# Altium schematic sheet Input Protection.SchDoc
size A4; SheetNumber: 8; SheetTotal: 14
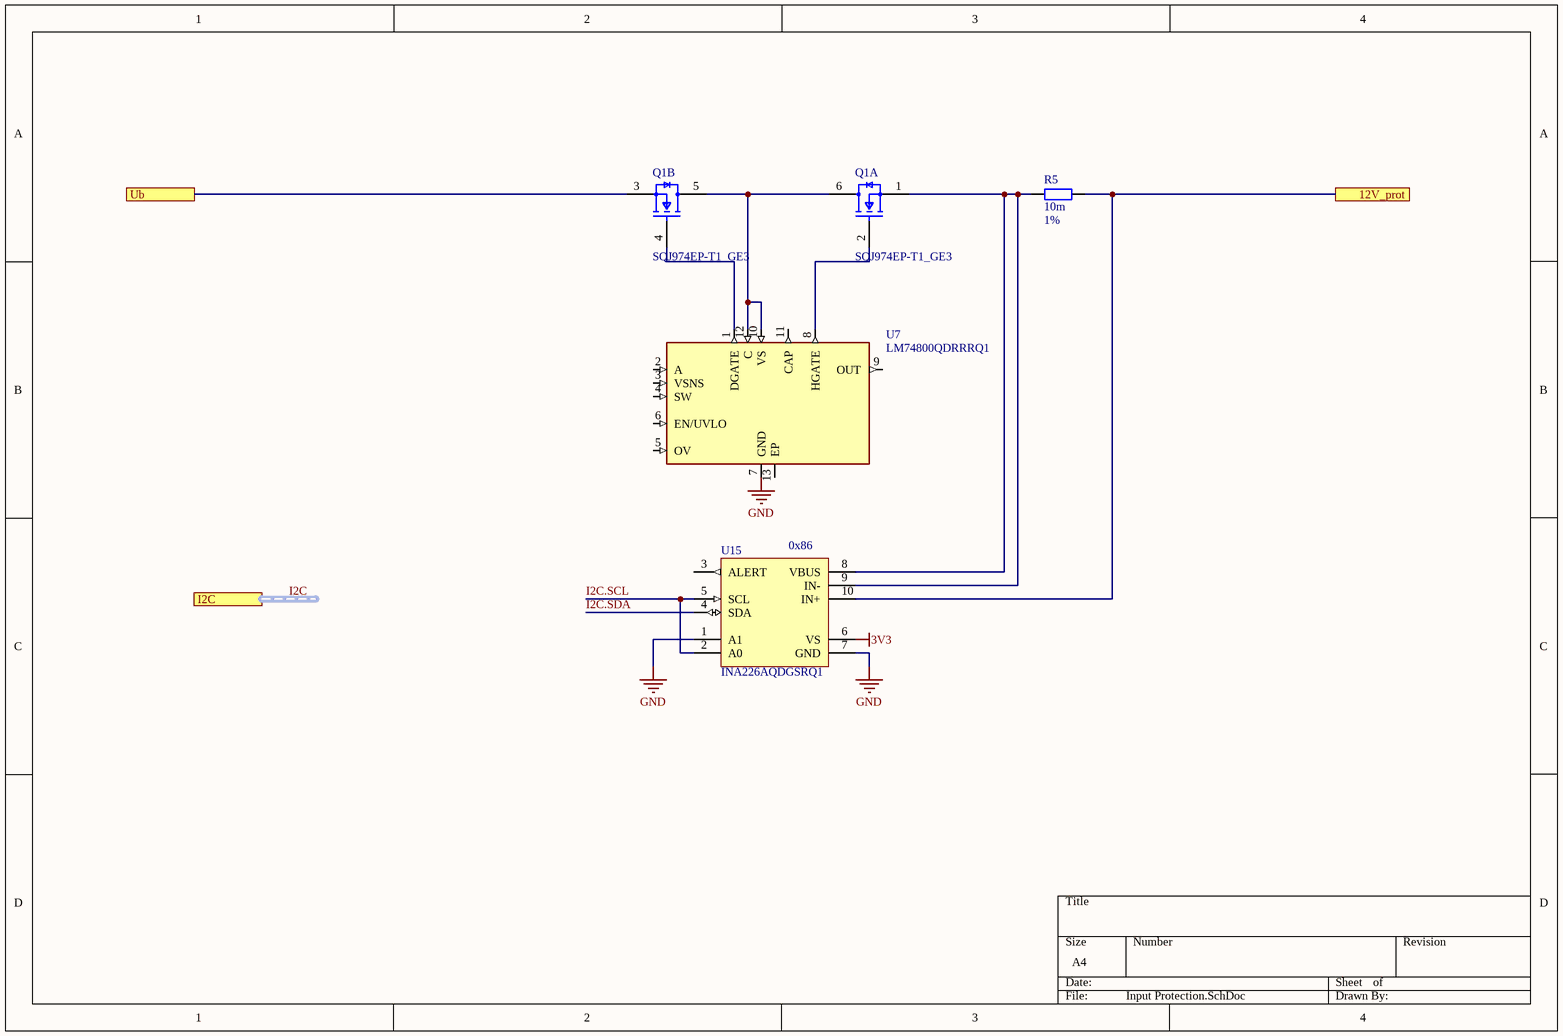
[diagram p0: Input Protection.SchDoc]

## Parts
Q1  SQJ974EP-T1_GE3  [FP-C21-1498-DUAL-MFG]  (parts A,B of 2)
R5  value 10m  Tolerance: 1%  [SMD_1206_RES]  (hidden comment: ERJ-8BWFR010V)
U7  LM74800QDRRRQ1  [FP-DRR0012E-IPC_B]
U15  INA226AQDGSRQ1  [TI-DGS0010A-VSSOP-10]

## Ports
12V_prot, I2C (harness I2C), Ub

## Nets
3V3: U15.6(VS)
GND: U7.7(GND) U15.1(A1) U15.7(GND)
12V_prot: R5.2 U15.10(IN+) ; port 12V_prot
I2C.SCL: U15.2(A0) U15.5(SCL)
I2C.SDA: U15.4(SDA)
Ub: Q1.3(S2) ; port Ub
NetQ1_1: Q1.1(S1) R5.1 U15.8(VBUS) U15.9(IN-)
NetQ1_2: Q1.2(G1) U7.8(HGATE)
NetQ1_4: Q1.4(G2) U7.1(DGATE)
NetQ1_5: Q1.5(D2) Q1.6(D1) U7.10(VS) U7.12(C)

Not connected (* = marked no-connect by the designer): U7 2(A) 3(VSNS) 4(SW) 5(OV) 6(EN/UVLO) 9(OUT) 11(CAP) 13(EP); U15 3(ALERT)

## Buses and harness runs
harness I2C = port I2C

## Notes on the sheet
- (near U15) 0x86

## Library data of the parts
Q1 = CMP-013-00038-A01: Mosfet, N-Ch, 100V, 30A, 175Deg C, 48W Rohs Compliant: Yes; Nominal Vgs: 4V; Vgs (Max): 10V; Transistor Type: Dual NFET; Operating Temperature (Max): 175°C; RoHS Compliant: Yes; Case/Package: SO8; Vds (Max): 100V; Drain current: 30A; Mounting Technology: SMT; Operating Temperature (Min): -55°C; Pins: 6
R5 = CMP-009-10450-A07: RES SMD 0.01 OHM 1% 1 1206 ±200ppm/°C; Power: 1W; Voltage Rating: 200V; Operating Temperature (Max): 125°C; Temperature Coefficient: ±200ppm/°C; Case/Package: 1206; Pins: 2; Mounting Technology: SMT; Operating Temperature (Min): -55°C; RoHS Compliant: Yes
U7 = CMP-019-00082-A01: AUTOMOTIVE IDEAL DIODE CONTROLLE OR Controller N+1 ORing Controller N-Channel 1: 1 12-WSON (3x3); Manufacturer Lifecycle Status: ACTIVE; Input Voltage (Min): 3V; Enable: yes; Number of Outputs: 1; Input Voltage (Max): 65V; Max Junction Temperature (Tj): 150°C; Pins: 12; Case/Package: WSON12; Operating Temperature (Max): 125°C; Width: 3mm; Thickness: 750µm; Operating Temperature (Min): -40°C; Height: 800µm; Length: 3mm; RoHS: Compliant
U15 = CMP-015-00037-A01: SP Amp Current Shunt and Power Monitor Dual 5.5V 10-Pin VSSOP T/R; Interface: I2C; Samples Frequency: 500kHz; Sample Resolution: 16; Supply Voltage (Min): 2.7V; Signal Type: Differential; Operating Temperature (Min): -40°C; Case/Package: VSSOP; Pins: 10; Supply Voltage (Max): 5.5V; Operating Temperature (Max): 125°C; RoHS Compliant: Yes; Mounting Technology: Surface Mount